# EAGLE design vape (EAGLE 7.2.0)
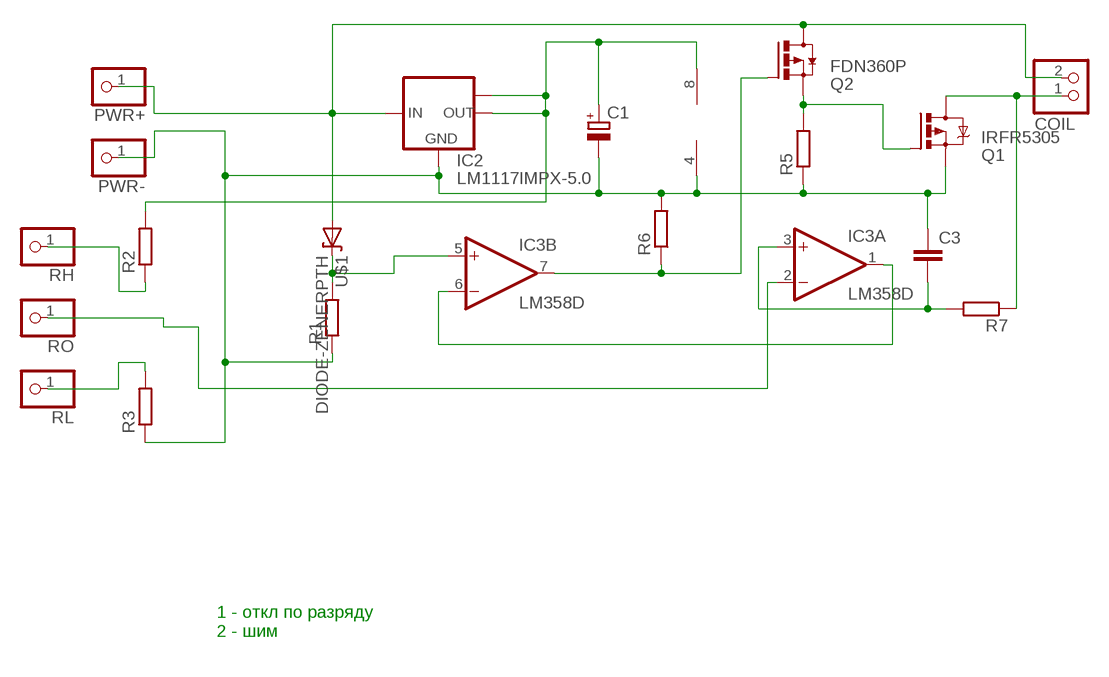
[diagram p0: schematic, sheet 1]

## Parts
C1  CPOL-EUSMCD  [SMC_D]
C3  C-EUC1206  [C1206]
COIL  PINHD-1X2  [1X02]
IC2  LM1117IMPX-5.0  [SOT223]
IC3  LM358D  [SO08]
PWR+  PINHD-1X1  [1X01]
PWR-  PINHD-1X1  [1X01]
Q1  IRFR5305  [D-PAK_TO252AA]
Q2  FDN360P  [SUPER-SOT3]
R1  R-EU_R1206  [R1206]
R2  R-EU_R1206  [R1206]
R3  R-EU_R1206  [R1206]
R5  R-EU_R1206  [R1206]
R6  R-EU_R1206  [R1206]
R7  R-EU_R1206  [R1206]
RH  PINHD-1X1  [1X01]
RL  PINHD-1X1  [1X01]
RO  PINHD-1X1  [1X01]
U$1  DIODE-ZENERPTH  [DIODE-ZENER]

## Nets
N$1: COIL.2 IC2.3(IN) PWR+.1 Q2.3(D) U$1.P$2(A)
N$2: IC3.1(A:OUT) IC3.6(B:-IN)
N$3: C1.- C3.1 IC2.1(GND) IC3.4(P:V-) PWR-.1 Q1.3(S) R1.1 R3.1 R5.1 R6.2
N$4: C3.2 IC3.3(A:+IN) R7.2
N$5: IC3.7(B:OUT) Q2.1(G) R6.1
N$6: C1.+ IC2.2(OUT) IC2.TAB(OUT1) IC3.8(P:V+) R2.2
N$7: R2.1 RH.1
N$8: Q1.1(G) Q2.2(S) R5.2
N$9: R3.2 RL.1
N$10: IC3.5(B:+IN) R1.2 U$1.P$1(C)
N$11: COIL.1 Q1.4(D) R7.1
N$14: IC3.2(A:-IN) RO.1

## Notes on the sheet
- 1 - откл по разряду
  2 - шим

## Library data of the parts
C1 = resistor:CPOL-EU: POLARIZED CAPACITOR, European symbol
C3 = rcl:C-EU: CAPACITOR, European symbol
COIL = pinhead:PINHD-1X2: PIN HEADER
IC2 = lm1117:LM1117IMPX-*
IC3 = linear:LM358: OP AMP also LM158; LM258; LM2904 Source: http://cache.national.com/ds/LM/LM158.pdf
PWR+ PWR- RH RL RO = pinhead:PINHD-1X1: PIN HEADER
Q1 = transistor-power:IRF?5305: HEXFET Power MOSFET Source: http://www.irf.com/product-info/datasheets/data/irfr5305pbf.pdf
Q2 = transistor-power:FDN360P: Single P-Channel, PowerTrench (R) MOSFET Source: http://www.fairchildsemi.com/ds/FD/FDN360P.pdf
R1-R3 R5-R7 = rcl:R-EU_: RESISTOR, European symbol
U$1 = SparkFun:DIODE-ZENER: Zener Diode Production Part - 8199 3.4V Zener Voltage

## Board
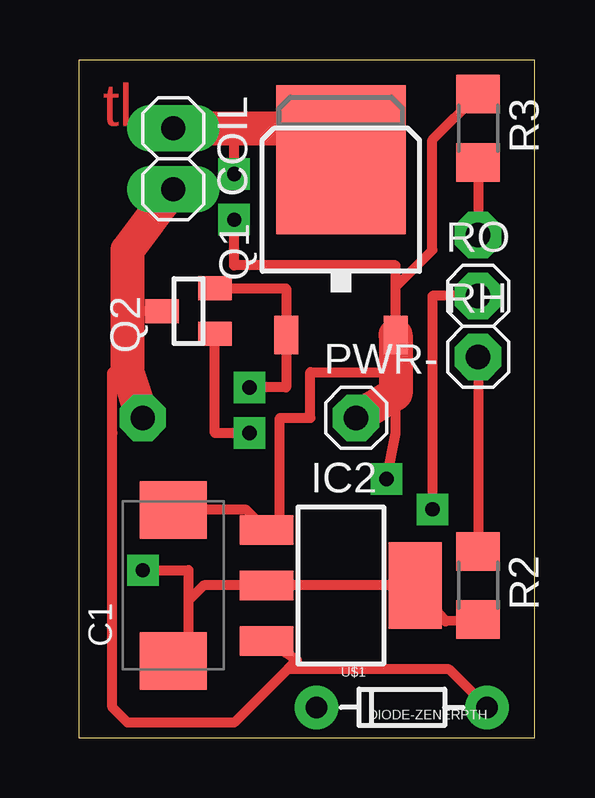
[diagram p1: board, top side]
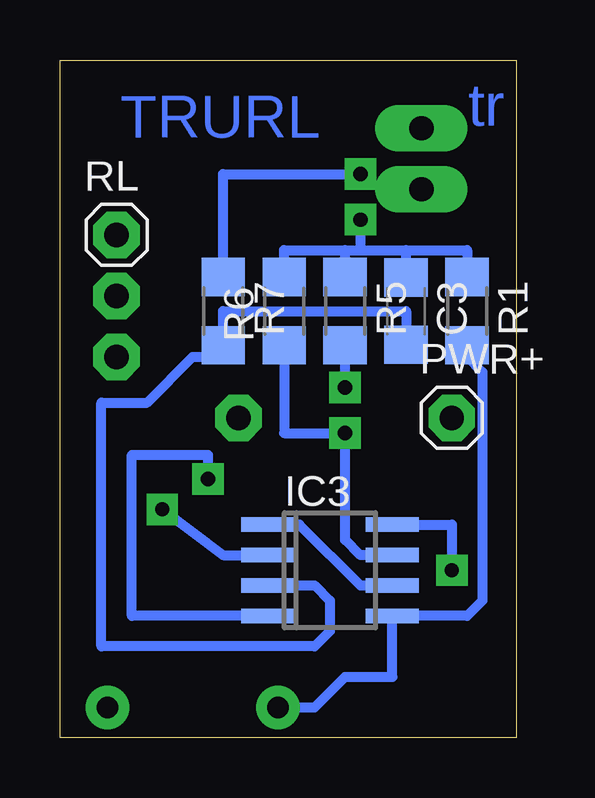
[diagram p2: board, bottom side, seen from below]

Size 19 x 28.25 mm. Coordinates in mm from the lower left corner, seen from the top.
Outline: 0,0 19,0 19,28.25 0,28.25 0,0
Copper layers (1*16): Top 0.035mm / dielectric 1.5mm / Bottom 0.035mm
Design rules "default *": minimum track width 10mil, minimum drill 24mil, track to track 8mil, track to pad 8mil, pad to pad 8mil, via to via 8mil, smd to smd 8mil, copper to edge 40mil, drill to drill 8mil, minimum pad ring 18mil, minimum via ring 14mil, stop-mask expansion 4mil, vias tented up to drill 0mil, thermal gap 10mil

### Footprints (pad centres in the part's own frame; a part is rotated, then mirrored left to right if it is on the bottom)
SMC_D = smd 2.4 x 2.8: + -3.15,0; - 3.15,0
C1206 = smd 1.6 x 1.8: 1 -1.4,0; 2 1.4,0
1X02 = drill 1.016 long: 1 -1.27,0; 2 1.27,0
SOT223 = smd 1.219 x 2.235: 1 -2.311,-3.099; 2 0,-3.099; 3 2.311,-3.099 | smd 3.6 x 2.2: TAB 0,3.099
SO08 = smd 0.6 x 2.2: 1 -1.905,-2.6; 2 -0.635,-2.6; 3 0.635,-2.6; 4 1.905,-2.6; 5 1.905,2.6; 6 0.635,2.6; 7 -0.635,2.6; 8 -1.905,2.6
1X01 = drill 1.016 octagon: 1 0,0
D-PAK_TO252AA = smd 1 x 1.6: 1 -2.28,-4.8; 3 2.28,-4.8 | smd 5.4 x 6.2: 4 0,2.5
SUPER-SOT3 = smd 1 x 1.4: 1 -0.95,-1.1; 2 0.95,-1.1; 3 0,1.1
R1206 = smd 1.6 x 1.803: 1 -1.422,0; 2 1.422,0
DIODE-ZENER = drill 0.9: P$1 -3.556,0; P$2 3.556,0

### Placement (x,y rotation side)
C1  3.95,6.35 90 top
C3  4.58,17.78 270 bottom
COIL  3.95,24.13 270 top
IC2  10.93,6.35 270 top
IC3  7.76,6.99 270 bottom
PWR+  2.67,13.34 0 bottom
PWR-  11.56,13.34 0 top
Q1  10.93,21.59 0 top
Q2  4.58,17.78 90 top
R1  2.04,17.78 270 bottom
R2  16.64,6.35 270 top
R3  16.64,25.4 270 top
R5  7.12,17.78 270 bottom
R6  9.66,17.78 90 bottom
R7  12.2,17.78 270 bottom
RH  16.64,15.88 0 top
RL  16.64,20.95 0 bottom
RO  16.64,18.41 0 top
U$1  13.47,1.27 0 top

### Tracks (layer width: path | path; a pad name or v marks a point on that pad's centre or on a via)
N$1
  Top 0.406: IC2.3 9.1,3.25 8.71,2.86 | 8.71,2.86 6.49,0.64 3.95,0.64 2.04,0.64 1.41,1.27 1.41,12.7 1.41,15.24 2.04,15.24 | Q2.3 2.04,17.78 | U$1.P$2 15.44,2.86 8.71,2.86
  Top 1.422: COIL.2 2.04,20.32 2.04,17.78 2.04,15.24 PWR+.1
N$2
  Bottom 0.406: IC3.1 9.03,8.89 6.49,6.35 IC3.6
N$3  (via drill 0.6)
  Top 0.406: Q1.3 13.21,18.79 | 13.21,18.79 14.74,20.32 14.74,24.92 R3.1 | 13.21,18.79 13.21,19.68 6.49,19.68 v6.49,21.59 | v12.84,10.79 13.21,12.7 13.21,14.35 | C1.- 6.99,9.5 IC2.1 8.39,8.66 8.39,13.34 9.66,13.34 9.66,15.24 13.21,15.24
  Top 1.422: Q1.3 13.21,15.24 13.21,14.35 PWR-.1
  Bottom 0.406: v6.49,21.59 6.49,20.32 | 6.49,20.32 4.58,20.32 | 4.58,20.32 2.04,20.32 R1.1 | C3.1 4.58,20.32 | R5.1 7.12,20.32 | 7.12,20.32 6.49,20.32 | R6.2 9.66,20.32 7.12,20.32 | IC3.4 16.01,5.08 16.01,11.79 12.84,11.79 v12.84,10.79
N$4
  Bottom 0.406: C3.2 4.58,17.78 12.2,17.78 R7.2 12.68,15.88 13.47,15.88 15.38,13.97 17.28,13.97 17.28,3.81 8.39,3.81 7.76,4.45 7.76,5.71 8.39,6.35 IC3.3
N$5  (via drill 0.6)
  Top 0.406: v7.12,12.7 5.68,12.7 Q2.1
  Bottom 0.406: R6.1 9.66,12.7 v7.12,12.7 7.12,8.26 6.49,7.62 IC3.7
N$6  (via drill 0.6)
  Top 0.406: 4.58,5.71 5.21,6.35 IC2.2 IC2.TAB 15.3,4.85 R2.2 | 4.58,5.71 4.58,3.83 C1.+ | v2.67,6.99 4.58,6.99 4.58,5.71
  Bottom 0.406: IC3.8 2.67,8.89 v2.67,6.99
N$7
  Top 0.406: RH.1 R2.1
N$8  (via drill 0.6)
  Top 0.406: v7.12,14.61 8.65,14.61 Q1.1 8.65,18.73 Q2.2
  Bottom 0.406: v7.12,14.61 R5.2
N$9
  Top 0.406: R3.2 RL.1
N$10
  Bottom 0.406: U$1.P$1 8.39,1.27 7.12,2.54 5.16,2.54 IC3.5 2.04,5.08 1.41,5.71 1.41,15.24 2.04,15.88 R1.2
N$11  (via drill 0.6)
  Top 0.406: v6.49,23.5 6.49,25.4
  Top 1.422: COIL.1 6.49,25.4 9.62,25.4 Q1.4
  Bottom 0.406: R7.1 12.2,23.5 v6.49,23.5
N$14  (via drill 0.6)
  Top 0.406: RO.1 14.74,18.41 v14.74,9.53
  Bottom 0.406: v14.74,9.53 12.2,7.62 IC3.2

### Text on the board
Top: tl
Bottom: tr | TRURL